# EAGLE schematic 3_power_controlled_sensors_schematics (EAGLE 6.1)
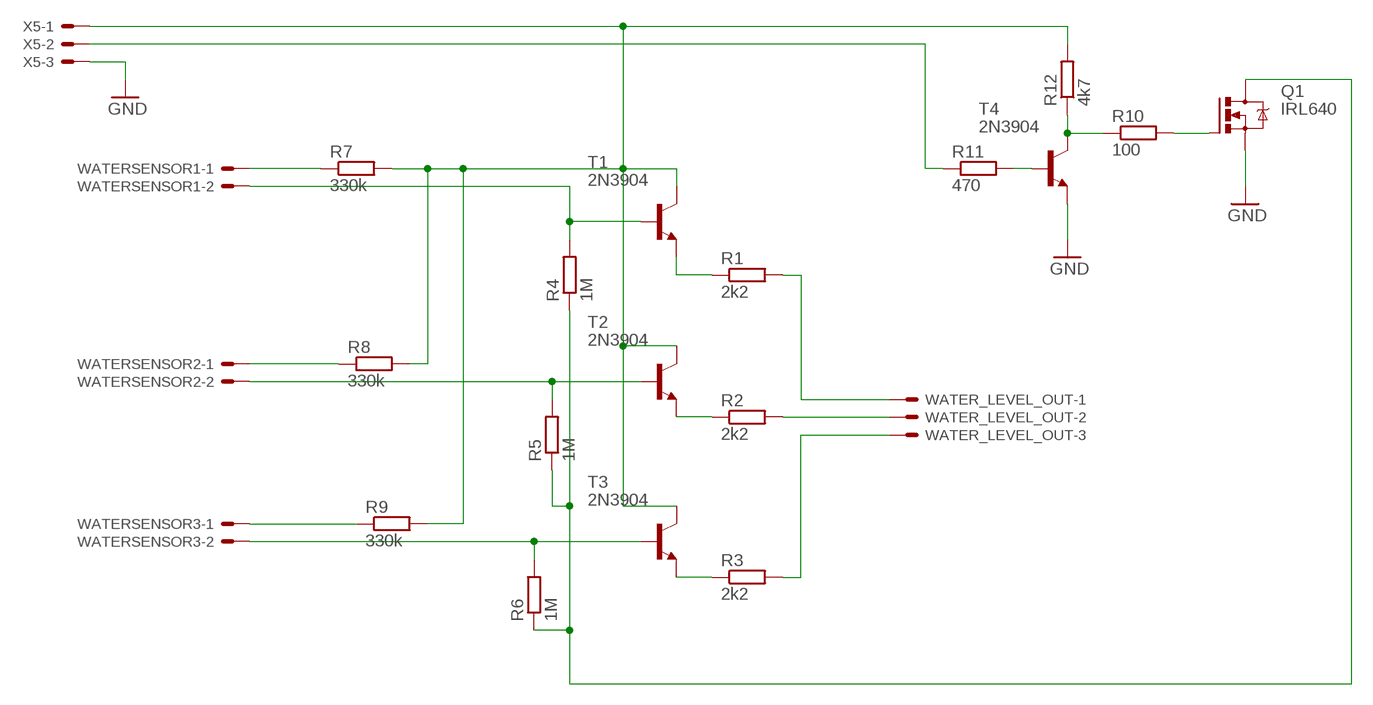
[diagram p0: schematic, sheet 1]

## Parts
Q1  IRL640  IRF740  [TO220BV]
R1  2k2  R-EU_0207/7  [0207/7]
R2  2k2  R-EU_0207/7  [0207/7]
R3  2k2  R-EU_0207/7  [0207/7]
R4  1M  R-EU_0207/7  [0207/7]
R5  1M  R-EU_0207/7  [0207/7]
R6  1M  R-EU_0207/7  [0207/7]
R7  330k  R-EU_0207/7  [0207/7]
R8  330k  R-EU_0207/7  [0207/7]
R9  330k  R-EU_0207/7  [0207/7]
R10  100  R-EU_0207/7  [0207/7]
R11  470  R-EU_0207/7  [0207/7]
R12  4k7  R-EU_0207/7  [0207/7]
T1  2N3904  [TO92]
T2  2N3904  [TO92]
T3  2N3904  [TO92]
T4  2N3904  [TO92]
WATER_LEVEL_OUT  22-23-2031  [22-23-2031]
WATERSENSOR1  22-23-2021  [22-23-2021]
WATERSENSOR2  22-23-2021  [22-23-2021]
WATERSENSOR3  22-23-2021  [22-23-2021]
X5  22-23-2031  [22-23-2031]

## Nets
GND: Q1.S T4.3(E) X5.3
N$2: R4.2 T1.2(B) WATERSENSOR1.2
N$3: R7.1 WATERSENSOR1.1
N$4: R9.1 WATERSENSOR3.1
N$5: R8.1 WATERSENSOR2.1
N$6: R5.2 T2.2(B) WATERSENSOR2.2
N$7: R6.2 T3.2(B) WATERSENSOR3.2
N$8: Q1.D R4.1 R5.1 R6.1
N$9: R1.1 T1.3(E)
N$10: R2.1 T2.3(E)
N$11: R3.1 T3.3(E)
N$12: R2.2 WATER_LEVEL_OUT.2
N$13: R3.2 WATER_LEVEL_OUT.3
N$14: R1.2 WATER_LEVEL_OUT.1
N$15: R11.2 T4.2(B)
N$16: R10.1 R12.1 T4.1(C)
N$17: Q1.G R10.2
N$18: R7.2 R8.2 R9.2 R12.2 T1.1(C) T2.1(C) T3.1(C) X5.1
N$19: R11.1 X5.2

## Library data of the parts
Q1 = transistor-power:IRF740: N-CHANNEL MOS FET
R1-R12 = resistor:R-EU_: RESISTOR, European symbol
T1-T4 = transistor:2N3904: NPN TRANSISTOR
WATER_LEVEL_OUT X5 = con-molex:22-23-2031: .100" (2.54mm) Center Header - 3 Pin; MF: MOLEX; MPN: 22-23-2031; OC_FARNELL: 1462950; OC_NEWARK: 30C0862
WATERSENSOR1-WATERSENSOR3 = con-molex:22-23-2021: .100" (2.54mm) Center Header - 2 Pin; MF: MOLEX; MPN: 22-23-2021; OC_FARNELL: 1462926; OC_NEWARK: 25C3832